# Altium project Goldstrike1_Rev01.PrjPCB
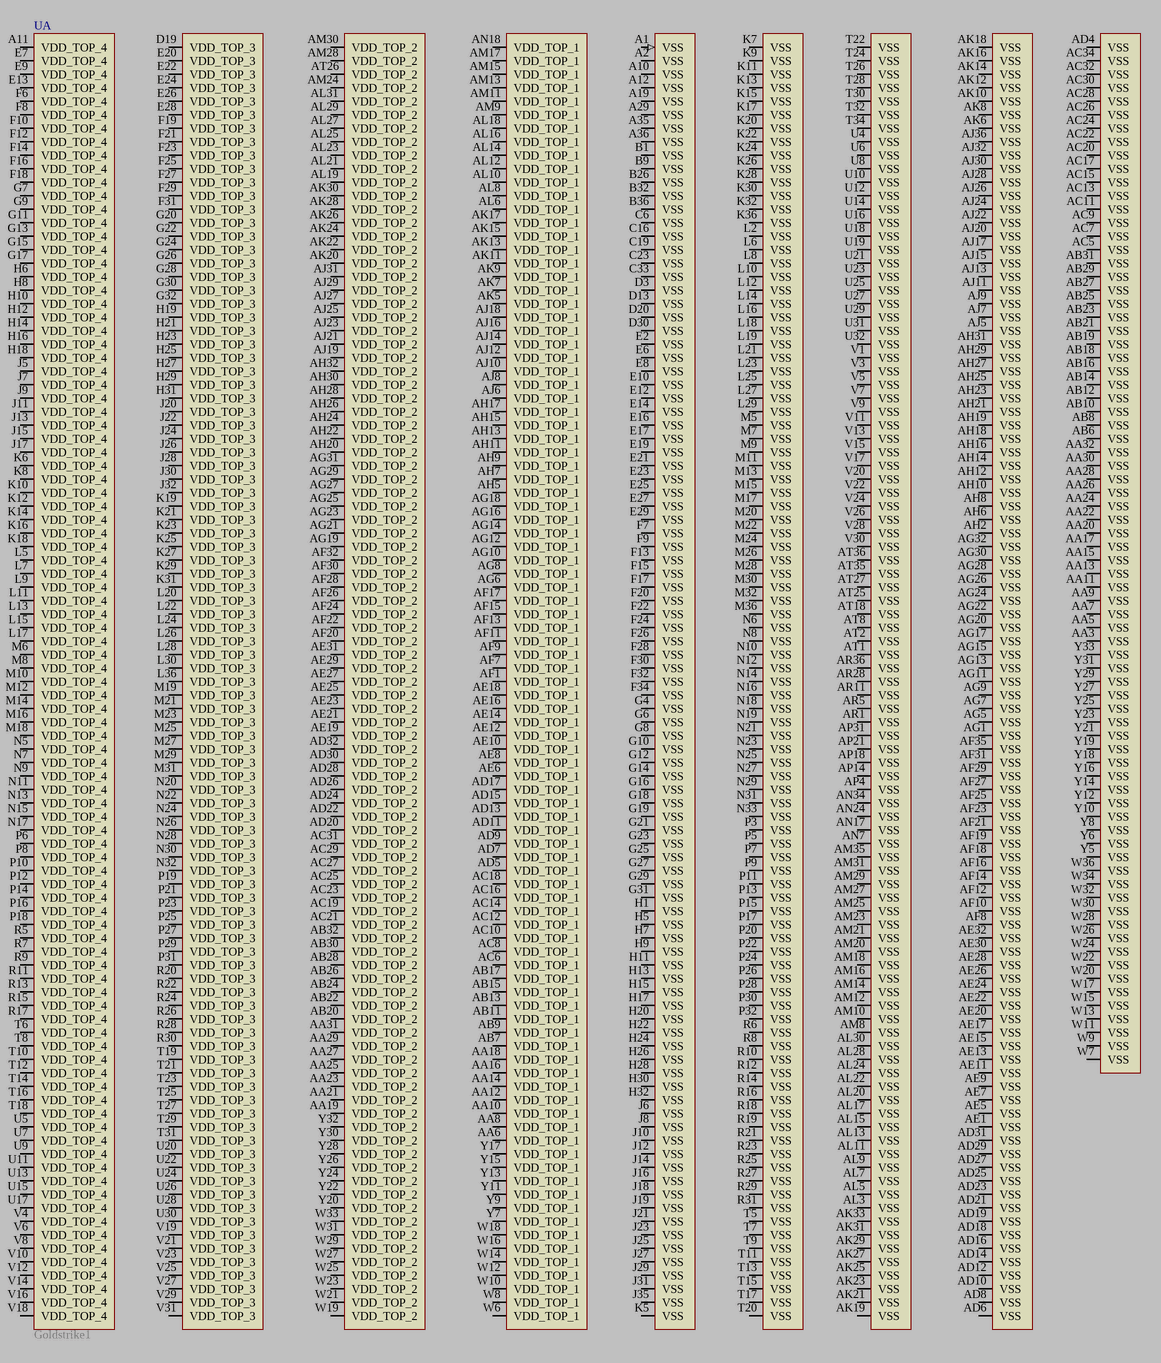
[diagram p0: PowerSupply.SchDoc]
3 sheets, 2 parts. Net scope: global (net labels, ports and power ports of the same name join across sheets).
Sheets:
  PowerSupply.SchDoc
  Core.SchDoc
  SMPS.SchDoc

## Sheet PowerSupply.SchDoc: Title
size A3; Date: Date; CompanyName: Integrated Micro-Electronics Bulgaria; Organization: Design & Development Department; Address1: Drawing Type; Address2: Address 1; Address3: Address 2; Address4: Address 3; DocumentNumber: 730xxx; Revision: 01; SheetNumber: 1; SheetTotal: 1; PageSetup: Record=PageOptions|CenterHorizontal=True|CenterVertical=True|PrintScale=0.70|XCorrection=1.00|YCorrection=1.00|PrintKind=2|BorderSize=5000000|LeftOffset=0|BottomOffset=0|Orientation=2|PaperLength=1000|PaperWidth=1000|Scale=100|PaperSource=7|PrintQuality=-4|MediaType=1|DitherType=10|PaperKind=A4|PrintScaleMode=1; SheetSize: A3; Time: Time; ModifiedDate: Mod. Date

### Parts
U  Goldstrike1  (part A of 5)

### Nets

Not connected (* = marked no-connect by the designer): U A1(VSS) A2(VSS) A10(VSS) A11(VDD_TOP_4) A12(VSS) A19(VSS) A29(VSS) A35(VSS) A36(VSS) AA3(VSS) AA5(VSS) AA6(VDD_TOP_1) AA7(VSS) AA8(VDD_TOP_1) AA9(VSS) AA10(VDD_TOP_1) AA11(VSS) AA12(VDD_TOP_1) AA13(VSS) AA14(VDD_TOP_1) AA15(VSS) AA16(VDD_TOP_1) AA17(VSS) AA18(VDD_TOP_1) AA19(VDD_TOP_2) AA20(VSS) AA21(VDD_TOP_2) AA22(VSS) AA23(VDD_TOP_2) AA24(VSS) AA25(VDD_TOP_2) AA26(VSS) AA27(VDD_TOP_2) AA28(VSS) AA29(VDD_TOP_2) AA30(VSS) AA31(VDD_TOP_2) AA32(VSS) AB6(VSS) AB7(VDD_TOP_1) AB8(VSS) AB9(VDD_TOP_1) AB10(VSS) AB11(VDD_TOP_1) AB12(VSS) AB13(VDD_TOP_1) AB14(VSS) AB15(VDD_TOP_1) AB16(VSS) AB17(VDD_TOP_1) AB18(VSS) AB19(VSS) AB20(VDD_TOP_2) AB21(VSS) AB22(VDD_TOP_2) AB23(VSS) AB24(VDD_TOP_2) AB25(VSS) AB26(VDD_TOP_2) AB27(VSS) AB28(VDD_TOP_2) AB29(VSS) AB30(VDD_TOP_2) AB31(VSS) AB32(VDD_TOP_2) AC5(VSS) AC6(VDD_TOP_1) AC7(VSS) AC8(VDD_TOP_1) AC9(VSS) AC10(VDD_TOP_1) AC11(VSS) AC12(VDD_TOP_1) AC13(VSS) AC14(VDD_TOP_1) AC15(VSS) AC16(VDD_TOP_1) AC17(VSS) AC18(VDD_TOP_1) AC19(VDD_TOP_2) AC20(VSS) AC21(VDD_TOP_2) AC22(VSS) AC23(VDD_TOP_2) AC24(VSS) AC25(VDD_TOP_2) AC26(VSS) AC27(VDD_TOP_2) AC28(VSS) AC29(VDD_TOP_2) AC30(VSS) AC31(VDD_TOP_2) AC32(VSS) AC34(VSS) AD4(VSS) AD5(VDD_TOP_1) AD6(VSS) AD7(VDD_TOP_1) AD8(VSS) AD9(VDD_TOP_1) AD10(VSS) AD11(VDD_TOP_1) AD12(VSS) AD13(VDD_TOP_1) AD14(VSS) AD15(VDD_TOP_1) AD16(VSS) AD17(VDD_TOP_1) AD18(VSS) AD19(VSS) AD20(VDD_TOP_2) AD21(VSS) AD22(VDD_TOP_2) AD23(VSS) AD24(VDD_TOP_2) AD25(VSS) AD26(VDD_TOP_2) AD27(VSS) AD28(VDD_TOP_2) AD29(VSS) AD30(VDD_TOP_2) AD31(VSS) AD32(VDD_TOP_2) AE1(VSS) AE5(VSS) AE6(VDD_TOP_1) AE7(VSS) AE8(VDD_TOP_1) AE9(VSS) AE10(VDD_TOP_1) AE11(VSS) AE12(VDD_TOP_1) AE13(VSS) AE14(VDD_TOP_1) AE15(VSS) AE16(VDD_TOP_1) AE17(VSS) AE18(VDD_TOP_1) AE19(VDD_TOP_2) AE20(VSS) AE21(VDD_TOP_2) AE22(VSS) AE23(VDD_TOP_2) AE24(VSS) AE25(VDD_TOP_2) AE26(VSS) AE27(VDD_TOP_2) AE28(VSS) AE29(VDD_TOP_2) AE30(VSS) AE31(VDD_TOP_2) AE32(VSS) AF1(VDD_TOP_1) AF7(VDD_TOP_1) AF8(VSS) AF9(VDD_TOP_1) AF10(VSS) AF11(VDD_TOP_1) AF12(VSS) AF13(VDD_TOP_1) AF14(VSS) AF15(VDD_TOP_1) AF16(VSS) AF17(VDD_TOP_1) AF18(VSS) AF19(VSS) AF20(VDD_TOP_2) AF21(VSS) AF22(VDD_TOP_2) AF23(VSS) AF24(VDD_TOP_2) AF25(VSS) AF26(VDD_TOP_2) AF27(VSS) AF28(VDD_TOP_2) AF29(VSS) AF30(VDD_TOP_2) AF31(VSS) AF32(VDD_TOP_2) AF35(VSS) AG1(VSS) AG5(VSS) AG6(VDD_TOP_1) AG7(VSS) AG8(VDD_TOP_1) AG9(VSS) AG10(VDD_TOP_1) AG11(VSS) AG12(VDD_TOP_1) AG13(VSS) AG14(VDD_TOP_1) AG15(VSS) AG16(VDD_TOP_1) AG17(VSS) AG18(VDD_TOP_1) AG19(VDD_TOP_2) AG20(VSS) AG21(VDD_TOP_2) AG22(VSS) AG23(VDD_TOP_2) AG24(VSS) AG25(VDD_TOP_2) AG26(VSS) AG27(VDD_TOP_2) AG28(VSS) AG29(VDD_TOP_2) AG30(VSS) AG31(VDD_TOP_2) AG32(VSS) AH2(VSS) AH5(VDD_TOP_1) AH6(VSS) AH7(VDD_TOP_1) AH8(VSS) AH9(VDD_TOP_1) AH10(VSS) AH11(VDD_TOP_1) AH12(VSS) AH13(VDD_TOP_1) AH14(VSS) AH15(VDD_TOP_1) AH16(VSS) AH17(VDD_TOP_1) AH18(VSS) AH19(VSS) AH20(VDD_TOP_2) AH21(VSS) AH22(VDD_TOP_2) AH23(VSS) AH24(VDD_TOP_2) AH25(VSS) AH26(VDD_TOP_2) AH27(VSS) AH28(VDD_TOP_2) AH29(VSS) AH30(VDD_TOP_2) AH31(VSS) AH32(VDD_TOP_2) AJ5(VSS) AJ6(VDD_TOP_1) AJ7(VSS) AJ8(VDD_TOP_1) AJ9(VSS) AJ10(VDD_TOP_1) AJ11(VSS) AJ12(VDD_TOP_1) AJ13(VSS) AJ14(VDD_TOP_1) AJ15(VSS) AJ16(VDD_TOP_1) AJ17(VSS) AJ18(VDD_TOP_1) AJ19(VDD_TOP_2) AJ20(VSS) AJ21(VDD_TOP_2) AJ22(VSS) AJ23(VDD_TOP_2) AJ24(VSS) AJ25(VDD_TOP_2) AJ26(VSS) AJ27(VDD_TOP_2) AJ28(VSS) AJ29(VDD_TOP_2) AJ30(VSS) AJ31(VDD_TOP_2) AJ32(VSS) AJ36(VSS) AK5(VDD_TOP_1) AK6(VSS) AK7(VDD_TOP_1) AK8(VSS) AK9(VDD_TOP_1) AK10(VSS) AK11(VDD_TOP_1) AK12(VSS) AK13(VDD_TOP_1) AK14(VSS) AK15(VDD_TOP_1) AK16(VSS) AK17(VDD_TOP_1) AK18(VSS) AK19(VSS) AK20(VDD_TOP_2) AK21(VSS) AK22(VDD_TOP_2) AK23(VSS) AK24(VDD_TOP_2) AK25(VSS) AK26(VDD_TOP_2) AK27(VSS) AK28(VDD_TOP_2) AK29(VSS) AK30(VDD_TOP_2) AK31(VSS) AK33(VSS) AL3(VSS) AL5(VSS) AL6(VDD_TOP_1) AL7(VSS) AL8(VDD_TOP_1) AL9(VSS) AL10(VDD_TOP_1) AL11(VSS) AL12(VDD_TOP_1) AL13(VSS) AL14(VDD_TOP_1) AL15(VSS) AL16(VDD_TOP_1) AL17(VSS) AL18(VDD_TOP_1) AL19(VDD_TOP_2) AL20(VSS) AL21(VDD_TOP_2) AL22(VSS) AL23(VDD_TOP_2) AL24(VSS) AL25(VDD_TOP_2) AL27(VDD_TOP_2) AL28(VSS) AL29(VDD_TOP_2) AL30(VSS) AL31(VDD_TOP_2) AM8(VSS) AM9(VDD_TOP_1) AM10(VSS) AM11(VDD_TOP_1) AM12(VSS) AM13(VDD_TOP_1) AM14(VSS) AM15(VDD_TOP_1) AM16(VSS) AM17(VDD_TOP_1) AM18(VSS) AM20(VSS) AM21(VSS) AM23(VSS) AM24(VDD_TOP_2) AM25(VSS) AM27(VSS) AM28(VDD_TOP_2) AM29(VSS) AM30(VDD_TOP_2) AM31(VSS) AM35(VSS) AN7(VSS) AN17(VSS) AN18(VDD_TOP_1) AN24(VSS) AN34(VSS) AP4(VSS) AP14(VSS) AP18(VSS) AP21(VSS) AP31(VSS) AR1(VSS) AR5(VSS) AR11(VSS) AR28(VSS) AR36(VSS) AT1(VSS) AT2(VSS) AT8(VSS) AT18(VSS) AT25(VSS) AT26(VDD_TOP_2) AT27(VSS) AT35(VSS) AT36(VSS) B1(VSS) B9(VSS) B26(VSS) B32(VSS) B36(VSS) C6(VSS) C16(VSS) C19(VSS) C23(VSS) C33(VSS) D3(VSS) D13(VSS) D19(VDD_TOP_3) D20(VSS) D30(VSS) E2(VSS) E6(VSS) E7(VDD_TOP_4) E8(VSS) E9(VDD_TOP_4) E10(VSS) E12(VSS) E13(VDD_TOP_4) E14(VSS) E16(VSS) E17(VSS) E19(VSS) E20(VDD_TOP_3) E21(VSS) E22(VDD_TOP_3) E23(VSS) E24(VDD_TOP_3) E25(VSS) E26(VDD_TOP_3) E27(VSS) E28(VDD_TOP_3) E29(VSS) F6(VDD_TOP_4) F7(VSS) F8(VDD_TOP_4) F9(VSS) F10(VDD_TOP_4) F12(VDD_TOP_4) F13(VSS) F14(VDD_TOP_4) F15(VSS) F16(VDD_TOP_4) F17(VSS) F18(VDD_TOP_4) F19(VDD_TOP_3) F20(VSS) F21(VDD_TOP_3) F22(VSS) F23(VDD_TOP_3) F24(VSS) F25(VDD_TOP_3) F26(VSS) F27(VDD_TOP_3) F28(VSS) F29(VDD_TOP_3) F30(VSS) F31(VDD_TOP_3) F32(VSS) F34(VSS) G4(VSS) G6(VSS) G7(VDD_TOP_4) G8(VSS) G9(VDD_TOP_4) G10(VSS) G11(VDD_TOP_4) G12(VSS) G13(VDD_TOP_4) G14(VSS) G15(VDD_TOP_4) G16(VSS) G17(VDD_TOP_4) G18(VSS) G19(VSS) G20(VDD_TOP_3) G21(VSS) G22(VDD_TOP_3) G23(VSS) G24(VDD_TOP_3) G25(VSS) G26(VDD_TOP_3) G27(VSS) G28(VDD_TOP_3) G29(VSS) G30(VDD_TOP_3) G31(VSS) G32(VDD_TOP_3) H1(VSS) H5(VSS) H6(VDD_TOP_4) H7(VSS) H8(VDD_TOP_4) H9(VSS) H10(VDD_TOP_4) H11(VSS) H12(VDD_TOP_4) H13(VSS) H14(VDD_TOP_4) H15(VSS) H16(VDD_TOP_4) H17(VSS) H18(VDD_TOP_4) H19(VDD_TOP_3) H20(VSS) H21(VDD_TOP_3) H22(VSS) H23(VDD_TOP_3) H24(VSS) H25(VDD_TOP_3) H26(VSS) H27(VDD_TOP_3) H28(VSS) H29(VDD_TOP_3) H30(VSS) H31(VDD_TOP_3) H32(VSS) J5(VDD_TOP_4) J6(VSS) J7(VDD_TOP_4) J8(VSS) J9(VDD_TOP_4) J10(VSS) J11(VDD_TOP_4) J12(VSS) J13(VDD_TOP_4) J14(VSS) J15(VDD_TOP_4) J16(VSS) J17(VDD_TOP_4) J18(VSS) J19(VSS) J20(VDD_TOP_3) J21(VSS) J22(VDD_TOP_3) J23(VSS) J24(VDD_TOP_3) J25(VSS) J26(VDD_TOP_3) J27(VSS) J28(VDD_TOP_3) J29(VSS) J30(VDD_TOP_3) J31(VSS) J32(VDD_TOP_3) J35(VSS) K5(VSS) K6(VDD_TOP_4) K7(VSS) K8(VDD_TOP_4) K9(VSS) K10(VDD_TOP_4) K11(VSS) K12(VDD_TOP_4) K13(VSS) K14(VDD_TOP_4) K15(VSS) K16(VDD_TOP_4) K17(VSS) K18(VDD_TOP_4) K19(VDD_TOP_3) K20(VSS) K21(VDD_TOP_3) K22(VSS) K23(VDD_TOP_3) K24(VSS) K25(VDD_TOP_3) K26(VSS) K27(VDD_TOP_3) K28(VSS) K29(VDD_TOP_3) K30(VSS) K31(VDD_TOP_3) K32(VSS) K36(VSS) L2(VSS) L5(VDD_TOP_4) L6(VSS) L7(VDD_TOP_4) L8(VSS) L9(VDD_TOP_4) L10(VSS) L11(VDD_TOP_4) L12(VSS) L13(VDD_TOP_4) L14(VSS) L15(VDD_TOP_4) L16(VSS) L17(VDD_TOP_4) L18(VSS) L19(VSS) L20(VDD_TOP_3) L21(VSS) L22(VDD_TOP_3) L23(VSS) L24(VDD_TOP_3) L25(VSS) L26(VDD_TOP_3) L27(VSS) L28(VDD_TOP_3) L29(VSS) L30(VDD_TOP_3) L36(VDD_TOP_3) M5(VSS) M6(VDD_TOP_4) M7(VSS) M8(VDD_TOP_4) M9(VSS) M10(VDD_TOP_4) M11(VSS) M12(VDD_TOP_4) M13(VSS) M14(VDD_TOP_4) M15(VSS) M16(VDD_TOP_4) M17(VSS) M18(VDD_TOP_4) M19(VDD_TOP_3) M20(VSS) M21(VDD_TOP_3) M22(VSS) M23(VDD_TOP_3) M24(VSS) M25(VDD_TOP_3) M26(VSS) M27(VDD_TOP_3) M28(VSS) M29(VDD_TOP_3) M30(VSS) M31(VDD_TOP_3) M32(VSS) M36(VSS) N5(VDD_TOP_4) N6(VSS) N7(VDD_TOP_4) N8(VSS) N9(VDD_TOP_4) N10(VSS) N11(VDD_TOP_4) N12(VSS) N13(VDD_TOP_4) N14(VSS) N15(VDD_TOP_4) N16(VSS) N17(VDD_TOP_4) N18(VSS) N19(VSS) N20(VDD_TOP_3) N21(VSS) N22(VDD_TOP_3) N23(VSS) N24(VDD_TOP_3) N25(VSS) N26(VDD_TOP_3) N27(VSS) N28(VDD_TOP_3) N29(VSS) N30(VDD_TOP_3) N31(VSS) N32(VDD_TOP_3) N33(VSS) P3(VSS) P5(VSS) P6(VDD_TOP_4) P7(VSS) P8(VDD_TOP_4) P9(VSS) P10(VDD_TOP_4) P11(VSS) P12(VDD_TOP_4) P13(VSS) P14(VDD_TOP_4) P15(VSS) P16(VDD_TOP_4) P17(VSS) P18(VDD_TOP_4) P19(VDD_TOP_3) P20(VSS) P21(VDD_TOP_3) P22(VSS) P23(VDD_TOP_3) P24(VSS) P25(VDD_TOP_3) P26(VSS) P27(VDD_TOP_3) P28(VSS) P29(VDD_TOP_3) P30(VSS) P31(VDD_TOP_3) P32(VSS) R5(VDD_TOP_4) R6(VSS) R7(VDD_TOP_4) R8(VSS) R9(VDD_TOP_4) R10(VSS) R11(VDD_TOP_4) R12(VSS) R13(VDD_TOP_4) R14(VSS) R15(VDD_TOP_4) R16(VSS) R17(VDD_TOP_4) R18(VSS) R19(VSS) R20(VDD_TOP_3) R21(VSS) R22(VDD_TOP_3) R23(VSS) R24(VDD_TOP_3) R25(VSS) R26(VDD_TOP_3) R27(VSS) R28(VDD_TOP_3) R29(VSS) R30(VDD_TOP_3) R31(VSS) T5(VSS) T6(VDD_TOP_4) T7(VSS) T8(VDD_TOP_4) T9(VSS) T10(VDD_TOP_4) T11(VSS) T12(VDD_TOP_4) T13(VSS) T14(VDD_TOP_4) T15(VSS) T16(VDD_TOP_4) T17(VSS) T18(VDD_TOP_4) T19(VDD_TOP_3) T20(VSS) T21(VDD_TOP_3) T22(VSS) T23(VDD_TOP_3) T24(VSS) T25(VDD_TOP_3) T26(VSS) T27(VDD_TOP_3) T28(VSS) T29(VDD_TOP_3) T30(VSS) T31(VDD_TOP_3) T32(VSS) T34(VSS) U4(VSS) U5(VDD_TOP_4) U6(VSS) U7(VDD_TOP_4) U8(VSS) U9(VDD_TOP_4) U10(VSS) U11(VDD_TOP_4) U12(VSS) U13(VDD_TOP_4) U14(VSS) U15(VDD_TOP_4) U16(VSS) U17(VDD_TOP_4) U18(VSS) U19(VSS) U20(VDD_TOP_3) U21(VSS) U22(VDD_TOP_3) U23(VSS) U24(VDD_TOP_3) U25(VSS) U26(VDD_TOP_3) U27(VSS) U28(VDD_TOP_3) U29(VSS) U30(VDD_TOP_3) U31(VSS) U32(VSS) V1(VSS) V3(VSS) V4(VDD_TOP_4) V5(VSS) V6(VDD_TOP_4) V7(VSS) V8(VDD_TOP_4) V9(VSS) V10(VDD_TOP_4) V11(VSS) V12(VDD_TOP_4) V13(VSS) V14(VDD_TOP_4) V15(VSS) V16(VDD_TOP_4) V17(VSS) V18(VDD_TOP_4) V19(VDD_TOP_3) V20(VSS) V21(VDD_TOP_3) V22(VSS) V23(VDD_TOP_3) V24(VSS) V25(VDD_TOP_3) V26(VSS) V27(VDD_TOP_3) V28(VSS) V29(VDD_TOP_3) V30(VSS) V31(VDD_TOP_3) W6(VDD_TOP_1) W7(VSS) W8(VDD_TOP_1) W9(VSS) W10(VDD_TOP_1) W11(VSS) W12(VDD_TOP_1) W13(VSS) W14(VDD_TOP_1) W15(VSS) W16(VDD_TOP_1) W17(VSS) W18(VDD_TOP_1) W19(VDD_TOP_2) W20(VSS) W21(VDD_TOP_2) W22(VSS) W23(VDD_TOP_2) W24(VSS) W25(VDD_TOP_2) W26(VSS) W27(VDD_TOP_2) W28(VSS) W29(VDD_TOP_2) W30(VSS) W31(VDD_TOP_2) W32(VSS) W33(VDD_TOP_2) W34(VSS) W36(VSS) Y5(VSS) Y6(VSS) Y7(VDD_TOP_1) Y8(VSS) Y9(VDD_TOP_1) Y10(VSS) Y11(VDD_TOP_1) Y12(VSS) Y13(VDD_TOP_1) Y14(VSS) Y15(VDD_TOP_1) Y16(VSS) Y17(VDD_TOP_1) Y18(VSS) Y19(VSS) Y20(VDD_TOP_2) Y21(VSS) Y22(VDD_TOP_2) Y23(VSS) Y24(VDD_TOP_2) Y25(VSS) Y26(VDD_TOP_2) Y27(VSS) Y28(VDD_TOP_2) Y29(VSS) Y30(VDD_TOP_2) Y31(VSS) Y32(VDD_TOP_2) Y33(VSS)

### Notes on the sheet
- Block Name
- Document Type: Schematic
- Size
- File Name
- Variant
- Rev.
- Project Name
- Sheet
- /

## Sheet Core.SchDoc: Title
size A3; Date: Date; CompanyName: Integrated Micro-Electronics Bulgaria; Organization: Design & Development Department; Address1: Drawing Type; Address2: Address 1; Address3: Address 2; Address4: Address 3; DocumentNumber: 730xxx; Revision: 01; SheetNumber: 1; SheetTotal: 1; PageSetup: Record=PageOptions|CenterHorizontal=True|CenterVertical=True|PrintScale=0.70|XCorrection=1.00|YCorrection=1.00|PrintKind=2|BorderSize=5000000|LeftOffset=0|BottomOffset=0|Orientation=2|PaperLength=1000|PaperWidth=1000|Scale=100|PaperSource=7|PrintQuality=-4|MediaType=1|DitherType=10|PaperKind=A4|PrintScaleMode=1; SheetSize: A3; Time: Time; ModifiedDate: Mod. Date
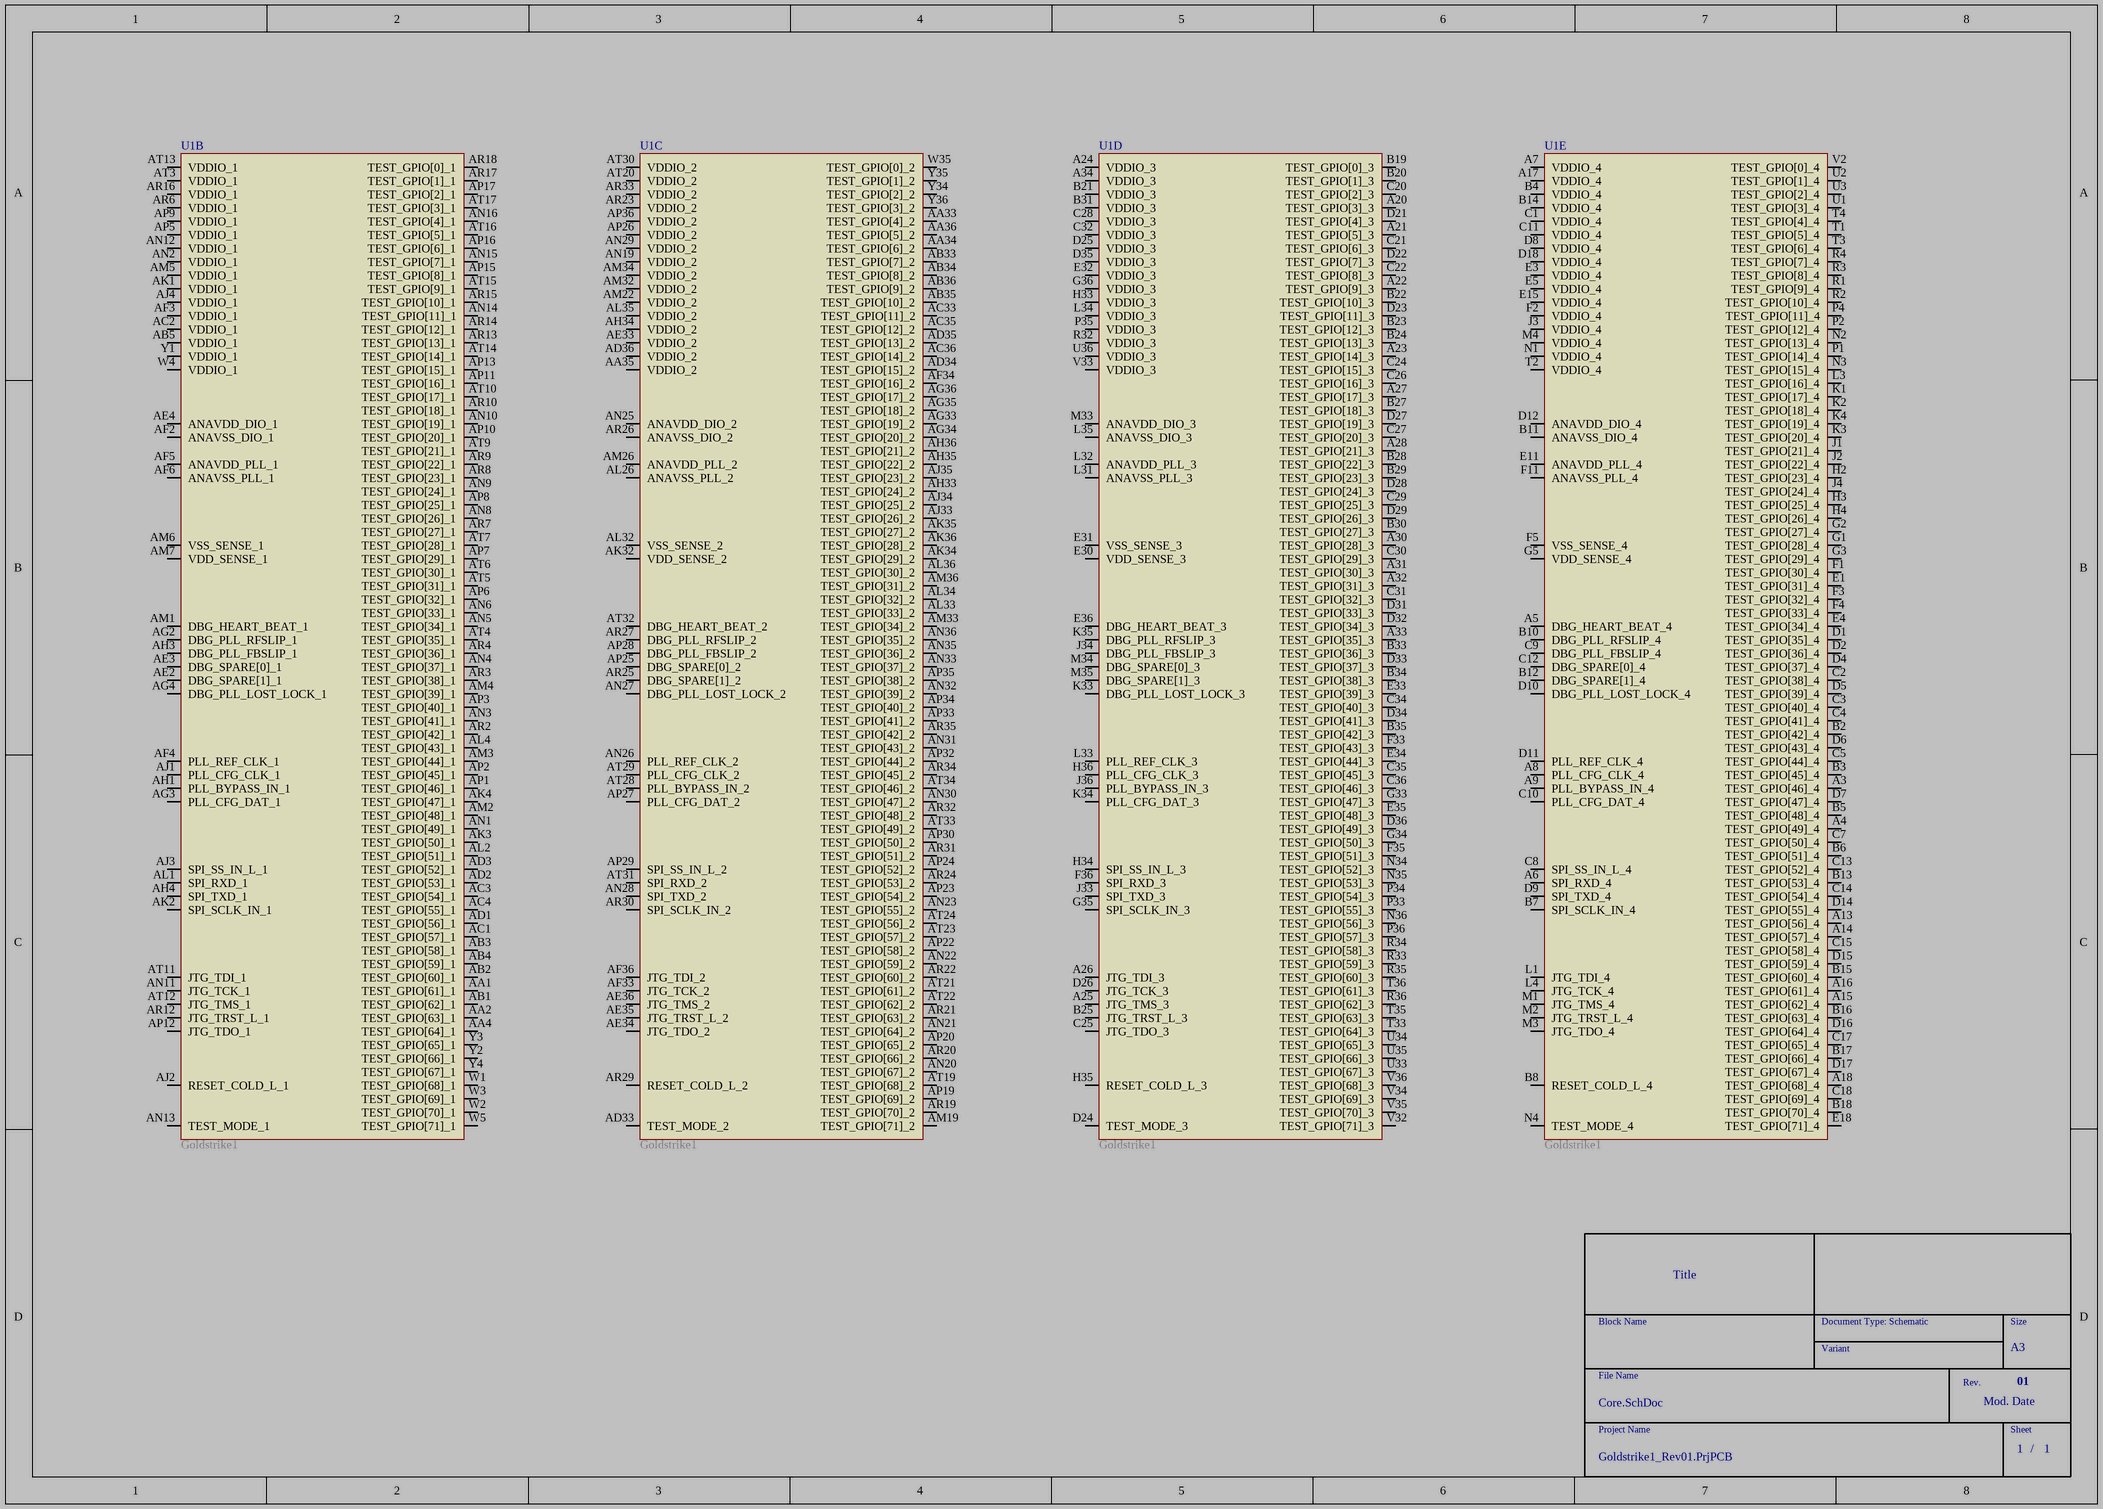
[diagram p1: Core.SchDoc]

### Parts
U1  Goldstrike1  (parts B,C,D,E of 5)

### Nets

Not connected (* = marked no-connect by the designer): U1 A3(TEST_GPIO[46]_4) A4(TEST_GPIO[49]_4) A5(DBG_HEART_BEAT_4) A6(SPI_RXD_4) A7(VDDIO_4) A8(PLL_CFG_CLK_4) A9(PLL_BYPASS_IN_4) A13(TEST_GPIO[56]_4) A14(TEST_GPIO[57]_4) A15(TEST_GPIO[62]_4) A16(TEST_GPIO[61]_4) A17(VDDIO_4) A18(TEST_GPIO[68]_4) A20(TEST_GPIO[3]_3) A21(TEST_GPIO[5]_3) A22(TEST_GPIO[9]_3) A23(TEST_GPIO[14]_3) A24(VDDIO_3) A25(JTG_TMS_3) A26(JTG_TDI_3) A27(TEST_GPIO[17]_3) A28(TEST_GPIO[21]_3) A30(TEST_GPIO[28]_3) A31(TEST_GPIO[30]_3) A32(TEST_GPIO[31]_3) A33(TEST_GPIO[35]_3) A34(VDDIO_3) AA1(TEST_GPIO[61]_1) AA2(TEST_GPIO[63]_1) AA4(TEST_GPIO[64]_1) AA33(TEST_GPIO[4]_2) AA34(TEST_GPIO[6]_2) AA35(VDDIO_2) AA36(TEST_GPIO[5]_2) AB1(TEST_GPIO[62]_1) AB2(TEST_GPIO[60]_1) AB3(TEST_GPIO[58]_1) AB4(TEST_GPIO[59]_1) AB5(VDDIO_1) AB33(TEST_GPIO[7]_2) AB34(TEST_GPIO[8]_2) AB35(TEST_GPIO[10]_2) AB36(TEST_GPIO[9]_2) AC1(TEST_GPIO[57]_1) AC2(VDDIO_1) AC3(TEST_GPIO[54]_1) AC4(TEST_GPIO[55]_1) AC33(TEST_GPIO[11]_2) AC35(TEST_GPIO[12]_2) AC36(TEST_GPIO[14]_2) AD1(TEST_GPIO[56]_1) AD2(TEST_GPIO[53]_1) AD3(TEST_GPIO[52]_1) AD33(TEST_MODE_2) AD34(TEST_GPIO[15]_2) AD35(TEST_GPIO[13]_2) AD36(VDDIO_2) AE2(DBG_SPARE[1]_1) AE3(DBG_SPARE[0]_1) AE4(ANAVDD_DIO_1) AE33(VDDIO_2) AE34(JTG_TDO_2) AE35(JTG_TRST_L_2) AE36(JTG_TMS_2) AF2(ANAVSS_DIO_1) AF3(VDDIO_1) AF4(PLL_REF_CLK_1) AF5(ANAVDD_PLL_1) AF6(ANAVSS_PLL_1) AF33(JTG_TCK_2) AF34(TEST_GPIO[16]_2) AF36(JTG_TDI_2) AG2(DBG_PLL_RFSLIP_1) AG3(PLL_CFG_DAT_1) AG4(DBG_PLL_LOST_LOCK_1) AG33(TEST_GPIO[19]_2) AG34(TEST_GPIO[20]_2) AG35(TEST_GPIO[18]_2) AG36(TEST_GPIO[17]_2) AH1(PLL_BYPASS_IN_1) AH3(DBG_PLL_FBSLIP_1) AH4(SPI_TXD_1) AH33(TEST_GPIO[24]_2) AH34(VDDIO_2) AH35(TEST_GPIO[22]_2) AH36(TEST_GPIO[21]_2) AJ1(PLL_CFG_CLK_1) AJ2(RESET_COLD_L_1) AJ3(SPI_SS_IN_L_1) AJ4(VDDIO_1) AJ33(TEST_GPIO[26]_2) AJ34(TEST_GPIO[25]_2) AJ35(TEST_GPIO[23]_2) AK1(VDDIO_1) AK2(SPI_SCLK_IN_1) AK3(TEST_GPIO[50]_1) AK4(TEST_GPIO[47]_1) AK32(VDD_SENSE_2) AK34(TEST_GPIO[29]_2) AK35(TEST_GPIO[27]_2) AK36(TEST_GPIO[28]_2) AL1(SPI_RXD_1) AL2(TEST_GPIO[51]_1) AL4(TEST_GPIO[43]_1) AL26(ANAVSS_PLL_2) AL32(VSS_SENSE_2) AL33(TEST_GPIO[33]_2) AL34(TEST_GPIO[32]_2) AL35(VDDIO_2) AL36(TEST_GPIO[30]_2) AM1(DBG_HEART_BEAT_1) AM2(TEST_GPIO[48]_1) AM3(TEST_GPIO[44]_1) AM4(TEST_GPIO[39]_1) AM5(VDDIO_1) AM6(VSS_SENSE_1) AM7(VDD_SENSE_1) AM19(TEST_GPIO[71]_2) AM22(VDDIO_2) AM26(ANAVDD_PLL_2) AM32(VDDIO_2) AM33(TEST_GPIO[34]_2) AM34(VDDIO_2) AM36(TEST_GPIO[31]_2) AN1(TEST_GPIO[49]_1) AN2(VDDIO_1) AN3(TEST_GPIO[41]_1) AN4(TEST_GPIO[37]_1) AN5(TEST_GPIO[34]_1) AN6(TEST_GPIO[33]_1) AN8(TEST_GPIO[26]_1) AN9(TEST_GPIO[24]_1) AN10(TEST_GPIO[19]_1) AN11(JTG_TCK_1) AN12(VDDIO_1) AN13(TEST_MODE_1) AN14(TEST_GPIO[11]_1) AN15(TEST_GPIO[7]_1) AN16(TEST_GPIO[4]_1) AN19(VDDIO_2) AN20(TEST_GPIO[67]_2) AN21(TEST_GPIO[64]_2) AN22(TEST_GPIO[59]_2) AN23(TEST_GPIO[55]_2) AN25(ANAVDD_DIO_2) AN26(PLL_REF_CLK_2) AN27(DBG_PLL_LOST_LOCK_2) AN28(SPI_TXD_2) AN29(VDDIO_2) AN30(TEST_GPIO[47]_2) AN31(TEST_GPIO[43]_2) AN32(TEST_GPIO[39]_2) AN33(TEST_GPIO[37]_2) AN35(TEST_GPIO[36]_2) AN36(TEST_GPIO[35]_2) AP1(TEST_GPIO[46]_1) AP2(TEST_GPIO[45]_1) AP3(TEST_GPIO[40]_1) AP5(VDDIO_1) AP6(TEST_GPIO[32]_1) AP7(TEST_GPIO[29]_1) AP8(TEST_GPIO[25]_1) AP9(VDDIO_1) AP10(TEST_GPIO[20]_1) AP11(TEST_GPIO[16]_1) AP12(JTG_TDO_1) AP13(TEST_GPIO[15]_1) AP15(TEST_GPIO[8]_1) AP16(TEST_GPIO[6]_1) AP17(TEST_GPIO[2]_1) AP19(TEST_GPIO[69]_2) AP20(TEST_GPIO[65]_2) AP22(TEST_GPIO[58]_2) AP23(TEST_GPIO[54]_2) AP24(TEST_GPIO[52]_2) AP25(DBG_SPARE[0]_2) AP26(VDDIO_2) AP27(PLL_CFG_DAT_2) AP28(DBG_PLL_FBSLIP_2) AP29(SPI_SS_IN_L_2) AP30(TEST_GPIO[50]_2) AP32(TEST_GPIO[44]_2) AP33(TEST_GPIO[41]_2) AP34(TEST_GPIO[40]_2) AP35(TEST_GPIO[38]_2) AP36(VDDIO_2) AR2(TEST_GPIO[42]_1) AR3(TEST_GPIO[38]_1) AR4(TEST_GPIO[36]_1) AR6(VDDIO_1) AR7(TEST_GPIO[27]_1) AR8(TEST_GPIO[23]_1) AR9(TEST_GPIO[22]_1) AR10(TEST_GPIO[18]_1) AR12(JTG_TRST_L_1) AR13(TEST_GPIO[13]_1) AR14(TEST_GPIO[12]_1) AR15(TEST_GPIO[10]_1) AR16(VDDIO_1) AR17(TEST_GPIO[1]_1) AR18(TEST_GPIO[0]_1) AR19(TEST_GPIO[70]_2) AR20(TEST_GPIO[66]_2) AR21(TEST_GPIO[63]_2) AR22(TEST_GPIO[60]_2) AR23(VDDIO_2) AR24(TEST_GPIO[53]_2) AR25(DBG_SPARE[1]_2) AR26(ANAVSS_DIO_2) AR27(DBG_PLL_RFSLIP_2) AR29(RESET_COLD_L_2) AR30(SPI_SCLK_IN_2) AR31(TEST_GPIO[51]_2) AR32(TEST_GPIO[48]_2) AR33(VDDIO_2) AR34(TEST_GPIO[45]_2) AR35(TEST_GPIO[42]_2) AT3(VDDIO_1) AT4(TEST_GPIO[35]_1) AT5(TEST_GPIO[31]_1) AT6(TEST_GPIO[30]_1) AT7(TEST_GPIO[28]_1) AT9(TEST_GPIO[21]_1) AT10(TEST_GPIO[17]_1) AT11(JTG_TDI_1) AT12(JTG_TMS_1) AT13(VDDIO_1) AT14(TEST_GPIO[14]_1) AT15(TEST_GPIO[9]_1) AT16(TEST_GPIO[5]_1) AT17(TEST_GPIO[3]_1) AT19(TEST_GPIO[68]_2) AT20(VDDIO_2) AT21(TEST_GPIO[61]_2) AT22(TEST_GPIO[62]_2) AT23(TEST_GPIO[57]_2) AT24(TEST_GPIO[56]_2) AT28(PLL_BYPASS_IN_2) AT29(PLL_CFG_CLK_2) AT30(VDDIO_2) AT31(SPI_RXD_2) AT32(DBG_HEART_BEAT_2) AT33(TEST_GPIO[49]_2) AT34(TEST_GPIO[46]_2) B2(TEST_GPIO[42]_4) B3(TEST_GPIO[45]_4) B4(VDDIO_4) B5(TEST_GPIO[48]_4) B6(TEST_GPIO[51]_4) B7(SPI_SCLK_IN_4) B8(RESET_COLD_L_4) B10(DBG_PLL_RFSLIP_4) B11(ANAVSS_DIO_4) B12(DBG_SPARE[1]_4) B13(TEST_GPIO[53]_4) B14(VDDIO_4) B15(TEST_GPIO[60]_4) B16(TEST_GPIO[63]_4) B17(TEST_GPIO[66]_4) B18(TEST_GPIO[70]_4) B19(TEST_GPIO[0]_3) B20(TEST_GPIO[1]_3) B21(VDDIO_3) B22(TEST_GPIO[10]_3) B23(TEST_GPIO[12]_3) B24(TEST_GPIO[13]_3) B25(JTG_TRST_L_3) B27(TEST_GPIO[18]_3) B28(TEST_GPIO[22]_3) B29(TEST_GPIO[23]_3) B30(TEST_GPIO[27]_3) B31(VDDIO_3) B33(TEST_GPIO[36]_3) B34(TEST_GPIO[38]_3) B35(TEST_GPIO[42]_3) C1(VDDIO_4) C2(TEST_GPIO[38]_4) C3(TEST_GPIO[40]_4) C4(TEST_GPIO[41]_4) C5(TEST_GPIO[44]_4) C7(TEST_GPIO[50]_4) C8(SPI_SS_IN_L_4) C9(DBG_PLL_FBSLIP_4) C10(PLL_CFG_DAT_4) C11(VDDIO_4) C12(DBG_SPARE[0]_4) C13(TEST_GPIO[52]_4) C14(TEST_GPIO[54]_4) C15(TEST_GPIO[58]_4) C17(TEST_GPIO[65]_4) C18(TEST_GPIO[69]_4) C20(TEST_GPIO[2]_3) C21(TEST_GPIO[6]_3) C22(TEST_GPIO[8]_3) C24(TEST_GPIO[15]_3) C25(JTG_TDO_3) C26(TEST_GPIO[16]_3) C27(TEST_GPIO[20]_3) C28(VDDIO_3) C29(TEST_GPIO[25]_3) C30(TEST_GPIO[29]_3) C31(TEST_GPIO[32]_3) C32(VDDIO_3) C34(TEST_GPIO[40]_3) C35(TEST_GPIO[45]_3) C36(TEST_GPIO[46]_3) D1(TEST_GPIO[35]_4) D2(TEST_GPIO[36]_4) D4(TEST_GPIO[37]_4) D5(TEST_GPIO[39]_4) D6(TEST_GPIO[43]_4) D7(TEST_GPIO[47]_4) D8(VDDIO_4) D9(SPI_TXD_4) D10(DBG_PLL_LOST_LOCK_4) D11(PLL_REF_CLK_4) D12(ANAVDD_DIO_4) D14(TEST_GPIO[55]_4) D15(TEST_GPIO[59]_4) D16(TEST_GPIO[64]_4) D17(TEST_GPIO[67]_4) D18(VDDIO_4) D21(TEST_GPIO[4]_3) D22(TEST_GPIO[7]_3) D23(TEST_GPIO[11]_3) D24(TEST_MODE_3) D25(VDDIO_3) D26(JTG_TCK_3) D27(TEST_GPIO[19]_3) D28(TEST_GPIO[24]_3) D29(TEST_GPIO[26]_3) D31(TEST_GPIO[33]_3) D32(TEST_GPIO[34]_3) D33(TEST_GPIO[37]_3) D34(TEST_GPIO[41]_3) D35(VDDIO_3) D36(TEST_GPIO[49]_3) E1(TEST_GPIO[31]_4) E3(VDDIO_4) E4(TEST_GPIO[34]_4) E5(VDDIO_4) E11(ANAVDD_PLL_4) E15(VDDIO_4) E18(TEST_GPIO[71]_4) E30(VDD_SENSE_3) E31(VSS_SENSE_3) E32(VDDIO_3) E33(TEST_GPIO[39]_3) E34(TEST_GPIO[44]_3) E35(TEST_GPIO[48]_3) E36(DBG_HEART_BEAT_3) F1(TEST_GPIO[30]_4) F2(VDDIO_4) F3(TEST_GPIO[32]_4) F4(TEST_GPIO[33]_4) F5(VSS_SENSE_4) F11(ANAVSS_PLL_4) F33(TEST_GPIO[43]_3) F35(TEST_GPIO[51]_3) F36(SPI_RXD_3) G1(TEST_GPIO[28]_4) G2(TEST_GPIO[27]_4) G3(TEST_GPIO[29]_4) G5(VDD_SENSE_4) G33(TEST_GPIO[47]_3) G34(TEST_GPIO[50]_3) G35(SPI_SCLK_IN_3) G36(VDDIO_3) H2(TEST_GPIO[23]_4) H3(TEST_GPIO[25]_4) H4(TEST_GPIO[26]_4) H33(VDDIO_3) H34(SPI_SS_IN_L_3) H35(RESET_COLD_L_3) H36(PLL_CFG_CLK_3) J1(TEST_GPIO[21]_4) J2(TEST_GPIO[22]_4) J3(VDDIO_4) J4(TEST_GPIO[24]_4) J33(SPI_TXD_3) J34(DBG_PLL_FBSLIP_3) J36(PLL_BYPASS_IN_3) K1(TEST_GPIO[17]_4) K2(TEST_GPIO[18]_4) K3(TEST_GPIO[20]_4) K4(TEST_GPIO[19]_4) K33(DBG_PLL_LOST_LOCK_3) K34(PLL_CFG_DAT_3) K35(DBG_PLL_RFSLIP_3) L1(JTG_TDI_4) L3(TEST_GPIO[16]_4) L4(JTG_TCK_4) L31(ANAVSS_PLL_3) L32(ANAVDD_PLL_3) L33(PLL_REF_CLK_3) L34(VDDIO_3) L35(ANAVSS_DIO_3) M1(JTG_TMS_4) M2(JTG_TRST_L_4) M3(JTG_TDO_4) M4(VDDIO_4) M33(ANAVDD_DIO_3) M34(DBG_SPARE[0]_3) M35(DBG_SPARE[1]_3) N1(VDDIO_4) N2(TEST_GPIO[13]_4) N3(TEST_GPIO[15]_4) N4(TEST_MODE_4) N34(TEST_GPIO[52]_3) N35(TEST_GPIO[53]_3) N36(TEST_GPIO[56]_3) P1(TEST_GPIO[14]_4) P2(TEST_GPIO[12]_4) P4(TEST_GPIO[11]_4) P33(TEST_GPIO[55]_3) P34(TEST_GPIO[54]_3) P35(VDDIO_3) P36(TEST_GPIO[57]_3) R1(TEST_GPIO[9]_4) R2(TEST_GPIO[10]_4) R3(TEST_GPIO[8]_4) R4(TEST_GPIO[7]_4) R32(VDDIO_3) R33(TEST_GPIO[59]_3) R34(TEST_GPIO[58]_3) R35(TEST_GPIO[60]_3) R36(TEST_GPIO[62]_3) T1(TEST_GPIO[5]_4) T2(VDDIO_4) T3(TEST_GPIO[6]_4) T4(TEST_GPIO[4]_4) T33(TEST_GPIO[64]_3) T35(TEST_GPIO[63]_3) T36(TEST_GPIO[61]_3) U1(TEST_GPIO[3]_4) U2(TEST_GPIO[1]_4) U3(TEST_GPIO[2]_4) U33(TEST_GPIO[67]_3) U34(TEST_GPIO[65]_3) U35(TEST_GPIO[66]_3) U36(VDDIO_3) V2(TEST_GPIO[0]_4) V32(TEST_GPIO[71]_3) V33(VDDIO_3) V34(TEST_GPIO[69]_3) V35(TEST_GPIO[70]_3) V36(TEST_GPIO[68]_3) W1(TEST_GPIO[68]_1) W2(TEST_GPIO[70]_1) W3(TEST_GPIO[69]_1) W4(VDDIO_1) W5(TEST_GPIO[71]_1) W35(TEST_GPIO[0]_2) Y1(VDDIO_1) Y2(TEST_GPIO[66]_1) Y3(TEST_GPIO[65]_1) Y4(TEST_GPIO[67]_1) Y34(TEST_GPIO[2]_2) Y35(TEST_GPIO[1]_2) Y36(TEST_GPIO[3]_2)

### Notes on the sheet
- Block Name
- Document Type: Schematic
- Size
- File Name
- Variant
- Rev.
- Project Name
- Sheet
- /

## Sheet SMPS.SchDoc: Title
size A3; Date: Date; CompanyName: Integrated Micro-Electronics Bulgaria; Organization: Design & Development Department; Address1: Drawing Type; Address2: Address 1; Address3: Address 2; Address4: Address 3; DocumentNumber: 730xxx; Revision: 01; SheetNumber: 1; SheetTotal: 1; PageSetup: Record=PageOptions|CenterHorizontal=True|CenterVertical=True|PrintScale=0.70|XCorrection=1.00|YCorrection=1.00|PrintKind=2|BorderSize=5000000|LeftOffset=0|BottomOffset=0|Orientation=2|PaperLength=1000|PaperWidth=1000|Scale=100|PaperSource=7|PrintQuality=-4|MediaType=1|DitherType=10|PaperKind=A4|PrintScaleMode=1; SheetSize: A3; Time: Time; ModifiedDate: Mod. Date
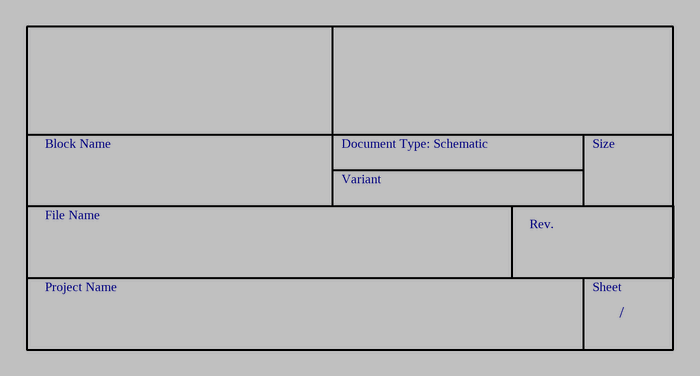
[diagram p2: SMPS.SchDoc]

### Notes on the sheet
- Block Name
- Document Type: Schematic
- Size
- File Name
- Variant
- Rev.
- Project Name
- Sheet
- /